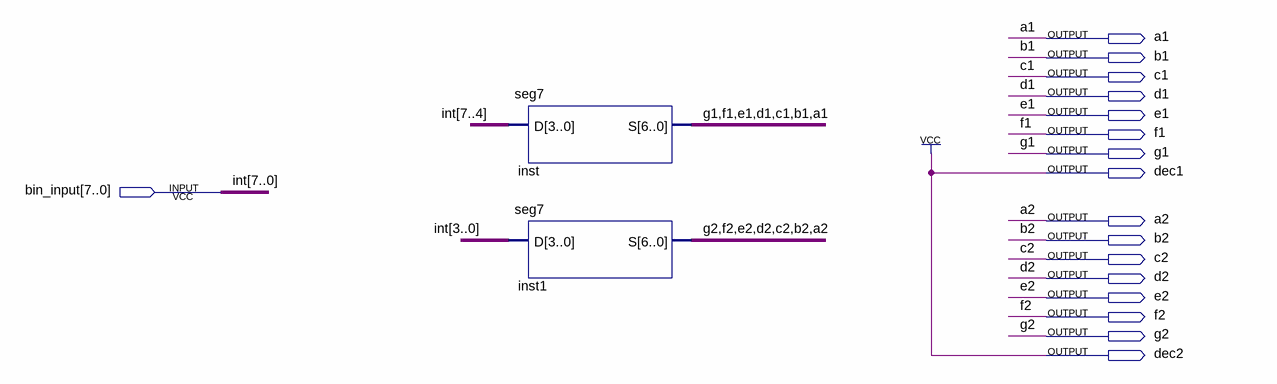
[diagram p0: schematic sheet]
// Quartus schematic 8binToSevSeg.bdf as structural Verilog: 2 symbols, 17 pins
module \8binToSevSeg  (
  input  [7:0] bin_input,
  output a1,
  output b1,
  output c1,
  output d1,
  output e1,
  output f1,
  output g1,
  output dec1,
  output a2,
  output b2,
  output c2,
  output d2,
  output e2,
  output f2,
  output g2,
  output dec2
);

  seg7 inst (.D(bin_input[7:4]), .S({g1, f1, e1, d1, c1, b1, a1}));
  seg7 inst1 (.D(bin_input[3:0]), .S({g2, f2, e2, d2, c2, b2, a2}));

  assign dec1 = 1'b1;
  assign dec2 = 1'b1;

  // Other names for the same wires on the sheet: int[7:0] = bin_input
endmodule
